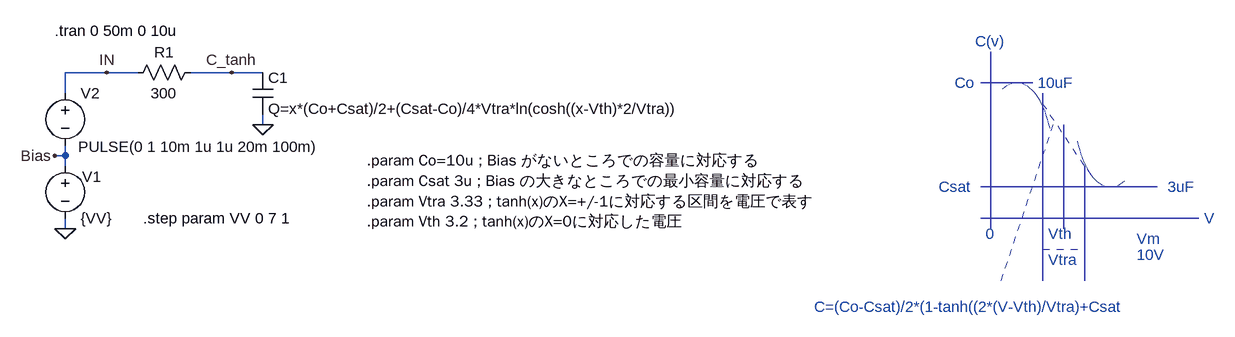
[diagram p0: schematic Fig_2-105_VdepndCap_tanh_Pulse.asc]
Fig_2-105_VdepndCap_tanh_Pulse.asc, the LTspice schematic file:
Version 4
SHEET 1 1988 680
WIRE 96 128 32 128
WIRE 144 128 96 128
WIRE 288 128 224 128
WIRE 336 128 288 128
WIRE 32 160 32 128
WIRE 336 208 336 192
WIRE 32 256 32 240
WIRE 32 256 16 256
WIRE 32 272 32 256
WIRE 32 368 32 352
FLAG 32 368 0
FLAG 336 208 0
FLAG 288 128 C_tanh
FLAG 16 256 Bias
FLAG 96 128 IN
SYMBOL voltage 32 256 R0
WINDOW 123 0 0 Left 0
WINDOW 39 0 0 Left 0
WINDOW 0 26 32 Left 2
SYMATTR InstName V1
SYMATTR Value {VV}
SYMBOL cap 320 128 R0
SYMATTR InstName C1
SYMATTR Value Q=x*(Co+Csat)/2+(Csat-Co)/4*Vtra*ln(cosh((x-Vth)*2/Vtra))
SYMBOL voltage 32 144 R0
WINDOW 3 20 98 Left 2
WINDOW 123 0 0 Left 0
WINDOW 39 0 0 Left 0
SYMATTR Value PULSE(0 1 10m 1u 1u 20m 100m)
SYMATTR InstName V2
SYMBOL res 128 144 R270
WINDOW 0 32 56 VTop 2
WINDOW 3 0 56 VBottom 2
SYMATTR InstName R1
SYMATTR Value 300
TEXT 152 352 Left 2 !.step param VV 0 7 1
TEXT 16 64 Left 2 !.tran 0 50m 0 10u
TEXT 496 264 Left 2 !.param Co=10u ; Bias がないところでの容量に対応する\n.param Csat 3u ; Bias の大きなところでの最小容量に対応する\n.param Vtra 3.33 ; tanh(x)のX=+/-1に対応する区間を電圧で表す\n.param Vth 3.2 ; tanh(x)のX=0に対応した電圧
TEXT 1528 144 Left 2 ;10uF
TEXT 1728 304 Left 2 ;3uF
TEXT 1432 80 Left 2 ;C(v)
TEXT 1784 352 Left 2 ;V
TEXT 1400 144 Left 2 ;Co
TEXT 1376 304 Left 2 ;Csat
TEXT 1680 384 Left 2 ;Vm
TEXT 1680 408 Left 2 ;10V
TEXT 1184 488 Left 2 ;C=(Co-Csat)/2*(1-tanh((2*(V-Vth)/Vtra)+Csat
TEXT 1544 416 Left 2 ;Vtra
TEXT 1544 376 Left 2 ;Vth
TEXT 1448 376 Left 2 ;0
LINE Normal 1456 368 1456 96
LINE Normal 1776 352 1440 352
LINE Normal 1600 272 1536 176 2
LINE Normal 1712 304 1440 304
LINE Normal 1600 448 1600 272
LINE Normal 1520 144 1440 144
LINE Normal 1472 448 1552 208 3
LINE Normal 1536 448 1536 160
LINE Normal 1568 368 1568 208
LINE Normal 1536 400 1600 400 3
ARC Normal 1440 384 1552 144 1607 155 1468 125 2
ARC Normal 1696 64 1584 304 1529 293 1668 323 2

The netlist it stands for:
* Fig_2-105_VdepndCap_tanh_Pulse.asc
V1 Bias 0 {VV}
C1 C_tanh 0 Q=x*(Co+Csat)/2+(Csat-Co)/4*Vtra*ln(cosh((x-Vth)*2/Vtra))
V2 IN Bias PULSE(0 1 10m 1u 1u 20m 100m)
R1 IN C_tanh 300
.step param VV 0 7 1
.tran 0 50m 0 10u
.param Co=10u ; Bias がないところでの容量に対応する
.param Csat 3u ; Bias の大きなところでの最小容量に対応する
.param Vtra 3.33 ; tanh(x)のX=+/-1に対応する区間を電圧で表す
.param Vth 3.2 ; tanh(x)のX=0に対応した電圧
* 10uF
* 3uF
* C(v)
* V
* Co
* Csat
* Vm
* 10V
* C=(Co-Csat)/2*(1-tanh((2*(V-Vth)/Vtra)+Csat
* Vtra
* Vth
* 0
.backanno
.end